# EAGLE schematic PCB-TLY-JACK-LEDS (EAGLE 6.4)
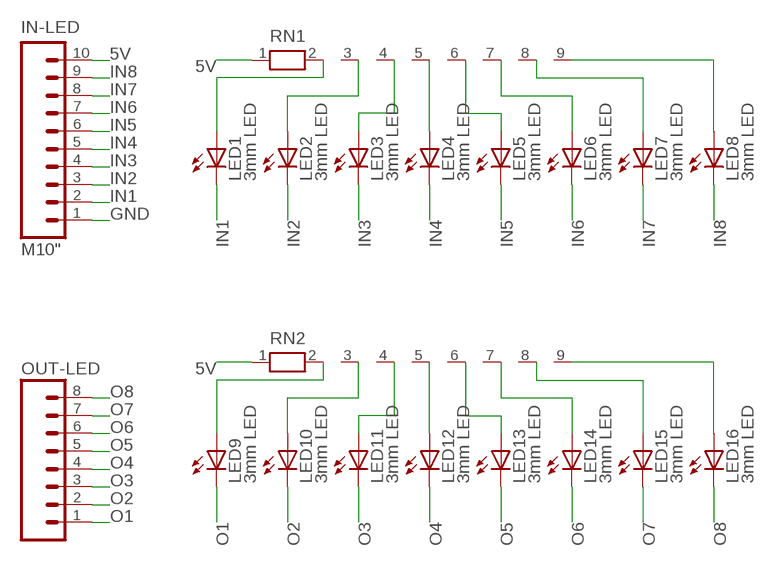
[diagram p0: schematic, sheet 1]

## Parts
IN-LED  M10"  [1X10]
LED1  3mm LED  LED3MM  [LED3MM]
LED2  3mm LED  LED3MM  [LED3MM]
LED3  3mm LED  LED3MM  [LED3MM]
LED4  3mm LED  LED3MM  [LED3MM]
LED5  3mm LED  LED3MM  [LED3MM]
LED6  3mm LED  LED3MM  [LED3MM]
LED7  3mm LED  LED3MM  [LED3MM]
LED8  3mm LED  LED3MM  [LED3MM]
LED9  3mm LED  LED3MM  [LED3MM]
LED10  3mm LED  LED3MM  [LED3MM]
LED11  3mm LED  LED3MM  [LED3MM]
LED12  3mm LED  LED3MM  [LED3MM]
LED13  3mm LED  LED3MM  [LED3MM]
LED14  3mm LED  LED3MM  [LED3MM]
LED15  3mm LED  LED3MM  [LED3MM]
LED16  3mm LED  LED3MM  [LED3MM]
OUT-LED  M081X08  [1X08]
RN1  RN08  [RN-9]
RN2  RN08  [RN-9]

## Nets
5V [Power]: IN-LED.10 RN1.1 RN2.1
GND [Power]: IN-LED.1
IN1: IN-LED.2 LED1.K(C)
IN2: IN-LED.3 LED2.K(C)
IN3: IN-LED.4 LED3.K(C)
IN4: IN-LED.5 LED4.K(C)
IN5: IN-LED.6 LED5.K(C)
IN6: IN-LED.7 LED6.K(C)
IN7: IN-LED.8 LED7.K(C)
IN8: IN-LED.9 LED8.K(C)
N$1: LED1.A RN1.2
N$2: LED2.A RN1.3
N$3: LED3.A RN1.4
N$4: LED4.A RN1.5
N$5: LED5.A RN1.6
N$6: LED6.A RN1.7
N$7: LED7.A RN1.8
N$8: LED8.A RN1.9
N$9: LED9.A RN2.2
N$10: LED10.A RN2.3
N$11: LED11.A RN2.4
N$12: LED12.A RN2.5
N$13: LED13.A RN2.6
N$14: LED14.A RN2.7
N$15: LED15.A RN2.8
N$16: LED16.A RN2.9
O1: LED9.K(C) OUT-LED.1
O2: LED10.K(C) OUT-LED.2
O3: LED11.K(C) OUT-LED.3
O4: LED12.K(C) OUT-LED.4
O5: LED13.K(C) OUT-LED.5
O6: LED14.K(C) OUT-LED.6
O7: LED15.K(C) OUT-LED.7
O8: LED16.K(C) OUT-LED.8

## Library data of the parts
IN-LED = SparkFun:M10: Header 10 Standard 10-pin 0.1" header. Use with straight break away headers (SKU : PRT-00116), right angle break away headers (PRT-00553), swiss pins (PRT-00743), machine pins (PRT-00117), and female headers (PRT-00115).
LED1-LED16 = SKAARHOJ:LED: KINGBRIGHT 20MM BIG LAMP
OUT-LED = SparkFun:M08: Header 8 Standard 8-pin 0.1" header. Use with straight break away headers (SKU : PRT-00116), right angle break away headers (PRT-00553), swiss pins (PRT-00743), machine pins (PRT-00117), and female headers (PRT-00115).
RN1 RN2 = SKAARHOJ:RN08: RESISTOR NETWORK; OC_FARNELL: unknown; OC_NEWARK: unknown

## Net classes
0 default: width 0.203 mm, drill 0.406 mm, clearance 0.203 mm
1 Power: width 0.406 mm, drill 0.61 mm, clearance 0.203 mm
2 RELAY LINES: width 0.406 mm, drill 0.61 mm, clearance 0.203 mm
3 INput lines: width 0.203 mm, drill 0.406 mm, clearance 0.203 mm